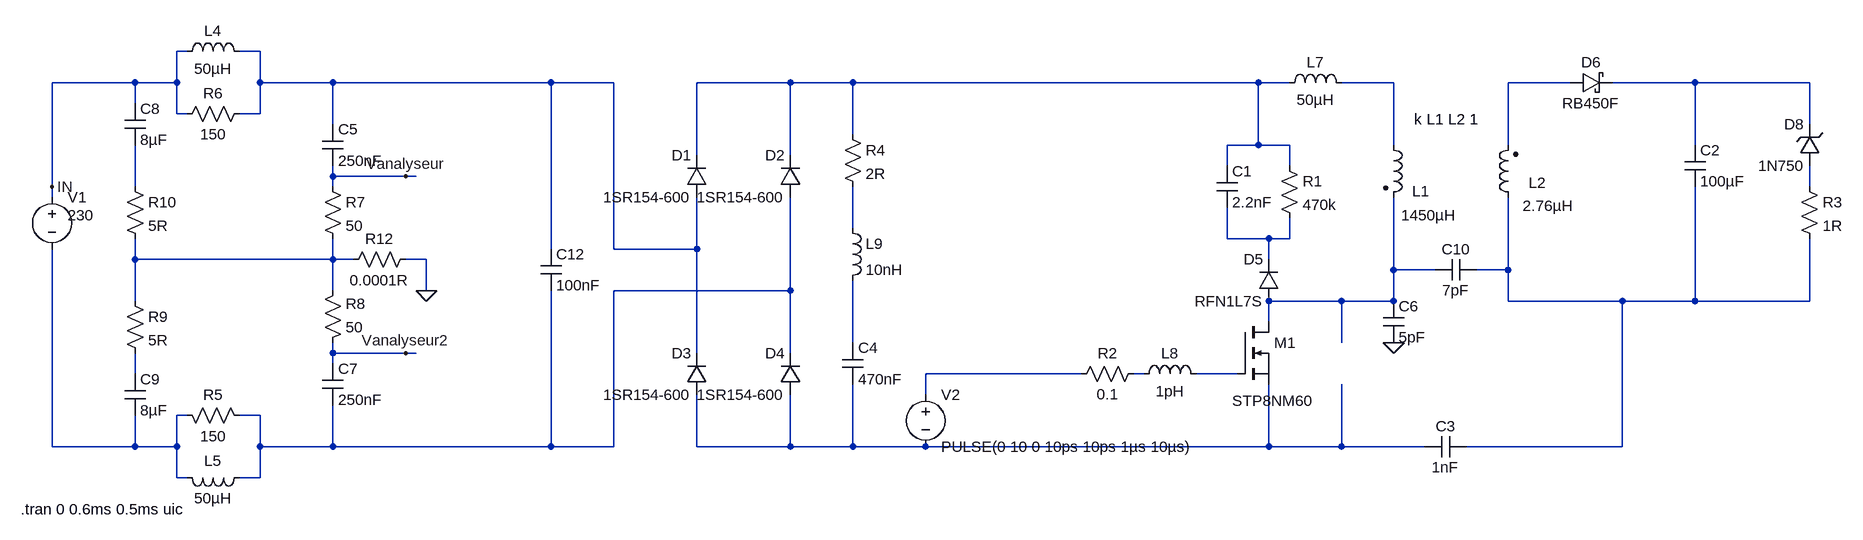
[diagram p0: schematic Part 5 - Flyback converter.asc]
Part 5 - Flyback converter.asc, the LTspice schematic file:
Version 4
SHEET 1 1992 744
WIRE -768 -64 -784 -64
WIRE -656 -64 -688 -64
WIRE -848 -16 -976 -16
WIRE -784 -16 -784 -64
WIRE -784 -16 -848 -16
WIRE -656 -16 -656 -64
WIRE -544 -16 -656 -16
WIRE -208 -16 -544 -16
WIRE -112 -16 -208 -16
WIRE 160 -16 16 -16
WIRE 256 -16 160 -16
WIRE 880 -16 256 -16
WIRE 928 -16 880 -16
WIRE 1088 -16 1008 -16
WIRE 1360 -16 1264 -16
WIRE 1552 -16 1424 -16
WIRE 1728 -16 1552 -16
WIRE -848 16 -848 -16
WIRE -784 32 -784 -16
WIRE -768 32 -784 32
WIRE -656 32 -656 -16
WIRE -656 32 -688 32
WIRE -544 48 -544 -16
WIRE 1728 48 1728 -16
WIRE 256 64 256 -16
WIRE 880 80 880 -16
WIRE 880 80 832 80
WIRE 928 80 880 80
WIRE 1088 80 1088 -16
WIRE 1264 80 1264 -16
WIRE 1552 80 1552 -16
WIRE 16 96 16 -16
WIRE 160 96 160 -16
WIRE 832 112 832 80
WIRE 928 112 928 80
WIRE -544 128 -544 112
WIRE -432 128 -544 128
WIRE -416 128 -432 128
WIRE -976 144 -976 -16
WIRE -848 144 -848 80
WIRE -544 144 -544 128
WIRE 1728 144 1728 112
WIRE -976 160 -976 144
WIRE 256 208 256 144
WIRE 832 224 832 176
WIRE 896 224 832 224
WIRE 928 224 928 192
WIRE 928 224 896 224
WIRE -208 240 -208 -16
WIRE -112 240 -112 -16
WIRE 16 240 16 160
WIRE 16 240 -112 240
WIRE -848 256 -848 224
WIRE -544 256 -544 224
WIRE -544 256 -848 256
WIRE -512 256 -544 256
WIRE -400 256 -432 256
WIRE 896 256 896 224
WIRE 1088 272 1088 160
WIRE 1152 272 1088 272
WIRE 1264 272 1264 160
WIRE 1264 272 1216 272
WIRE -544 304 -544 256
WIRE -400 304 -400 256
WIRE 160 304 160 160
WIRE 160 304 -112 304
WIRE -848 320 -848 256
WIRE 1008 320 896 320
WIRE 1088 320 1088 272
WIRE 1088 320 1008 320
WIRE 1264 320 1264 272
WIRE 1440 320 1264 320
WIRE 1552 320 1552 144
WIRE 1552 320 1440 320
WIRE 1728 320 1728 224
WIRE 1728 320 1552 320
WIRE 896 352 896 320
WIRE 256 384 256 288
WIRE 1008 384 1008 320
WIRE -544 400 -544 384
WIRE -432 400 -544 400
WIRE -416 400 -432 400
WIRE 16 400 16 240
WIRE 160 400 160 304
WIRE -544 416 -544 400
WIRE -848 432 -848 400
WIRE 608 432 368 432
WIRE 704 432 688 432
WIRE 848 432 784 432
WIRE 368 464 368 432
WIRE -768 496 -784 496
WIRE -656 496 -688 496
WIRE -976 544 -976 240
WIRE -848 544 -848 496
WIRE -848 544 -976 544
WIRE -784 544 -784 496
WIRE -784 544 -848 544
WIRE -656 544 -656 496
WIRE -544 544 -544 480
WIRE -544 544 -656 544
WIRE -208 544 -208 304
WIRE -208 544 -544 544
WIRE -112 544 -112 304
WIRE -112 544 -208 544
WIRE 16 544 16 464
WIRE 160 544 160 464
WIRE 160 544 16 544
WIRE 256 544 256 448
WIRE 256 544 160 544
WIRE 368 544 256 544
WIRE 896 544 896 448
WIRE 896 544 368 544
WIRE 1008 544 1008 448
WIRE 1008 544 896 544
WIRE 1136 544 1008 544
WIRE 1440 544 1440 320
WIRE 1440 544 1200 544
WIRE -784 592 -784 544
WIRE -768 592 -784 592
WIRE -656 592 -656 544
WIRE -656 592 -688 592
FLAG -976 144 IN
FLAG -432 128 Vanalyseur
FLAG -432 400 Vanalyseur2
FLAG -400 304 0
FLAG 1088 384 0
SYMBOL voltage -976 144 R0
WINDOW 123 0 0 Left 2
WINDOW 39 0 0 Left 2
WINDOW 3 24 44 Left 2
SYMATTR Value 230
SYMATTR InstName V1
SYMBOL ind -784 -48 R270
WINDOW 0 32 56 VTop 2
WINDOW 3 5 56 VBottom 2
SYMATTR InstName L4
SYMATTR Value 50µH
SYMBOL res -672 16 R90
WINDOW 0 0 56 VBottom 2
WINDOW 3 32 56 VTop 2
SYMATTR InstName R6
SYMATTR Value 150
SYMBOL cap -560 48 R0
SYMATTR InstName C5
SYMATTR Value 250nF
SYMBOL res -560 128 R0
SYMATTR InstName R7
SYMATTR Value 50
SYMBOL ind -784 576 M90
WINDOW 0 5 56 VBottom 2
WINDOW 3 32 56 VTop 2
SYMATTR InstName L5
SYMATTR Value 50µH
SYMBOL res -672 512 M270
WINDOW 0 32 56 VTop 2
WINDOW 3 0 56 VBottom 2
SYMATTR InstName R5
SYMATTR Value 150
SYMBOL cap -560 480 M180
WINDOW 0 24 56 Left 2
WINDOW 3 24 8 Left 2
SYMATTR InstName C7
SYMATTR Value 250nF
SYMBOL res -560 400 M180
WINDOW 0 36 76 Left 2
WINDOW 3 36 40 Left 2
SYMATTR InstName R8
SYMATTR Value 50
SYMBOL cap -864 16 R0
SYMATTR InstName C8
SYMATTR Value 8µF
SYMBOL cap -864 432 R0
SYMATTR InstName C9
SYMATTR Value 8µF
SYMBOL res -864 304 R0
SYMATTR InstName R9
SYMATTR Value 5R
SYMBOL res -864 128 R0
SYMATTR InstName R10
SYMATTR Value 5R
SYMBOL ind2 1072 64 R0
WINDOW 0 45 87 Left 2
WINDOW 3 28 124 Left 2
SYMATTR InstName L1
SYMATTR Value 1450µH
SYMATTR Type ind
SYMBOL ind2 1280 176 R180
WINDOW 0 -43 38 Left 2
WINDOW 3 -85 3 Left 2
SYMATTR InstName L2
SYMATTR Value 2.76µH
SYMATTR Type ind
SYMBOL ind 912 0 R270
WINDOW 0 32 56 VTop 2
WINDOW 3 5 56 VBottom 2
SYMATTR InstName L7
SYMATTR Value 50µH
SYMBOL nmos 848 352 R0
WINDOW 3 -8 121 Left 2
SYMATTR Value STP8NM60
SYMATTR InstName M1
SYMBOL diode 32 160 R180
WINDOW 0 24 64 Left 2
WINDOW 3 24 0 Left 2
SYMATTR InstName D1
SYMATTR Value 1SR154-600
SYMBOL diode 912 320 R180
WINDOW 0 24 64 Left 2
WINDOW 3 24 0 Left 2
SYMATTR InstName D5
SYMATTR Value RFN1L7S
SYMBOL cap 816 112 R0
SYMATTR InstName C1
SYMATTR Value 2.2nF
SYMATTR SpiceLine Lser=10nH
SYMBOL res 912 96 R0
SYMATTR InstName R1
SYMATTR Value 470k
SYMBOL voltage 368 448 R0
WINDOW 123 0 0 Left 0
WINDOW 39 0 0 Left 0
SYMATTR InstName V2
SYMATTR Value PULSE(0 10 0 10ps 10ps 1µs 10µs)
SYMBOL res 704 416 R90
WINDOW 0 0 56 VBottom 2
WINDOW 3 32 56 VTop 2
SYMATTR InstName R2
SYMATTR Value 0.1
SYMBOL ind 688 448 R270
WINDOW 0 32 56 VTop 2
WINDOW 3 5 56 VBottom 2
SYMATTR InstName L8
SYMATTR Value 1pH
SYMBOL diode 176 160 R180
WINDOW 0 24 64 Left 2
WINDOW 3 24 0 Left 2
SYMATTR InstName D2
SYMATTR Value 1SR154-600
SYMBOL diode 32 464 R180
WINDOW 0 24 64 Left 2
WINDOW 3 24 0 Left 2
SYMATTR InstName D3
SYMATTR Value 1SR154-600
SYMBOL diode 176 464 R180
WINDOW 0 24 64 Left 2
WINDOW 3 24 0 Left 2
SYMATTR InstName D4
SYMATTR Value 1SR154-600
SYMBOL schottky 1360 0 R270
WINDOW 0 32 32 VTop 2
WINDOW 3 0 32 VBottom 2
SYMATTR InstName D6
SYMATTR Value RB450F
SYMATTR Description Diode
SYMATTR Type diode
SYMBOL cap 1536 80 R0
SYMATTR InstName C2
SYMATTR Value 100µF
SYMATTR SpiceLine ic=5.3V
SYMBOL res 1712 128 R0
SYMATTR InstName R3
SYMATTR Value 1R
SYMBOL zener 1744 112 R180
WINDOW 0 24 64 Left 2
WINDOW 3 24 0 Left 2
SYMATTR InstName D8
SYMATTR Value 1N750
SYMATTR Description Diode
SYMATTR Type diode
SYMBOL cap 1200 528 R90
WINDOW 0 0 32 VBottom 2
WINDOW 3 32 32 VTop 2
SYMATTR InstName C3
SYMATTR Value 1nF
SYMBOL cap 240 384 R0
SYMATTR InstName C4
SYMATTR Value 470nF
SYMATTR SpiceLine ic=230V
SYMBOL res 240 48 R0
SYMATTR InstName R4
SYMATTR Value 2R
SYMBOL ind 240 192 R0
SYMATTR InstName L9
SYMATTR Value 10nH
SYMBOL cap 1072 320 R0
SYMATTR InstName C6
SYMATTR Value 5pF
SYMBOL cap 1216 256 R90
WINDOW 0 0 32 VBottom 2
WINDOW 3 32 32 VTop 2
SYMATTR InstName C10
SYMATTR Value 7pF
SYMBOL cap -224 240 R0
SYMATTR InstName C12
SYMATTR Value 100nF
SYMATTR SpiceLine Lser=1nH
SYMBOL res -416 240 R90
WINDOW 0 0 56 VBottom 2
WINDOW 3 32 56 VTop 2
SYMATTR InstName R12
SYMATTR Value 0.0001R
TEXT 1120 40 Left 2 !k L1 L2 1
TEXT -1024 640 Left 2 !.tran 0 0.6ms 0.5ms uic

The netlist it stands for:
* Part 5 - Flyback converter.asc
V1 IN N019 230
L4 IN N001 50µH
R6 N001 IN 150
C5 N001 Vanalyseur 250nF
R7 Vanalyseur N010 50
L5 N019 N013 50µH
R5 N013 N019 150
C7 N013 Vanalyseur2 250nF
R8 Vanalyseur2 N010 50
C8 IN N006 8µF
C9 N015 N019 8µF
R9 N010 N015 5R
R10 N006 N010 5R
L1 N003 N011 1450µH
L2 N012 N004 2.76µH
L7 N002 N003 50µH
M1 N011 N018 N020 N020 STP8NM60
D1 N001 N002 1SR154-600
D5 N011 N009 RFN1L7S
C1 N002 N009 2.2nF Lser=10nH
R1 N002 N009 470k
V2 N016 N020 PULSE(0 10 0 10ps 10ps 1µs 10µs)
R2 N017 N016 0.1
L8 N017 N018 1pH
D2 N013 N002 1SR154-600
D3 N020 N001 1SR154-600
D4 N020 N013 1SR154-600
D6 N004 N005 RB450F
C2 N005 N012 100µF ic=5.3V
R3 N007 N012 1R
D8 N007 N005 1N750
C3 N012 N020 1nF
C4 N014 N020 470nF ic=230V
R4 N002 N008 2R
L9 N008 N014 10nH
C6 N011 0 5pF
C10 N012 N011 7pF
C12 N001 N013 100nF Lser=1nH
R12 0 N010 0.0001R
.model D D
.lib standard.dio
.model NMOS NMOS
.model PMOS PMOS
.lib standard.mos
k L1 L2 1
.tran 0 0.6ms 0.5ms uic
.backanno
.end